# Altium schematic sheet OneChip.SchDoc
size A4
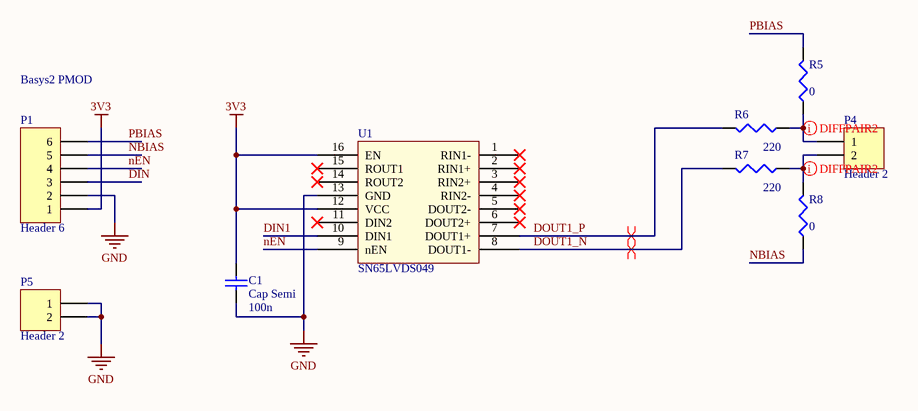
[diagram p0: OneChip.SchDoc]

## Parts
C1  Cap Semi  value 100n  [1608[0603]]
P1  Header 6  [HDR1X6]
P4  Header 2  [HDR1X2]
P5  Header 2  [HDR1X2]
R5  value 0  [J1-0603]  (hidden comment: Res3)
R6  value 220  [J1-0603]  (hidden comment: Res3)
R7  value 220  [J1-0603]  (hidden comment: Res3)
R8  value 0  [J1-0603]  (hidden comment: Res3)
U1  SN65LVDS049  [SOP127P600-8N]

## Nets
3V3: C1.2 P1.1 U1.12(VCC) U1.16(EN)
GND: C1.1 P1.2 P5.1 P5.2 U1.13(GND)
DIN: P1.3
DIN1: U1.10(DIN1)
DOUT1_N: R7.2 U1.8(DOUT1-)
DOUT1_P: R6.2 U1.7(DOUT1+)
NBIAS: P1.5 R8.1
nEN: P1.4 U1.9(nEN)
PBIAS: P1.6 R5.2
NetP4_1: P4.1 R5.1 R6.1
NetP4_2: P4.2 R7.1 R8.2

Not connected (* = marked no-connect by the designer): U1 1(RIN1-)* 2(RIN1+)* 3(RIN2+)* 4(RIN2-)* 5(DOUT2-)* 6(DOUT2+)* 11(DIN2)* 14(ROUT2)* 15(ROUT1)*

## Layout directives
differential pair: DOUT1_N, DOUT1_P, NetP4_1, NetP4_2

## Notes on the sheet
- Basys2 PMOD

## Library data of the parts
C1 = Cap Semi: Capacitor (Semiconductor SIM Model); Published: 8-Jun-2000; LatestRevisionDate: 29-May-2009; LatestRevisionNote: IPC-7351 Footprint Added.; PackageReference: C1206; Publisher: Altium Limited; PackageDescription: Chip Capacitor
P1 = Header 6: Header, 6-Pin; LatestRevisionDate: 17-Jul-2002; LatestRevisionNote: Re-released for DXP Platform.; Publisher: Altium Limited
P4 P5 = Header 2: Header, 2-Pin; LatestRevisionDate: 17-Jul-2002; LatestRevisionNote: Re-released for DXP Platform.; Publisher: Altium Limited
R5-R8 = Res3: Resistor; Published: 8-Jun-2000; LatestRevisionDate: 29-May-2009; LatestRevisionNote: IPC-7351 Footprint Added.; PackageReference: J1-0603; Publisher: Altium Limited; PackageDescription: Chip Resistor